# Altium schematic sheet Rover_PI_hat.SchDoc
size A; Author: Hannah Cho; DrawnBy: Hannah Cho; SheetNumber: 1; SheetTotal: 1
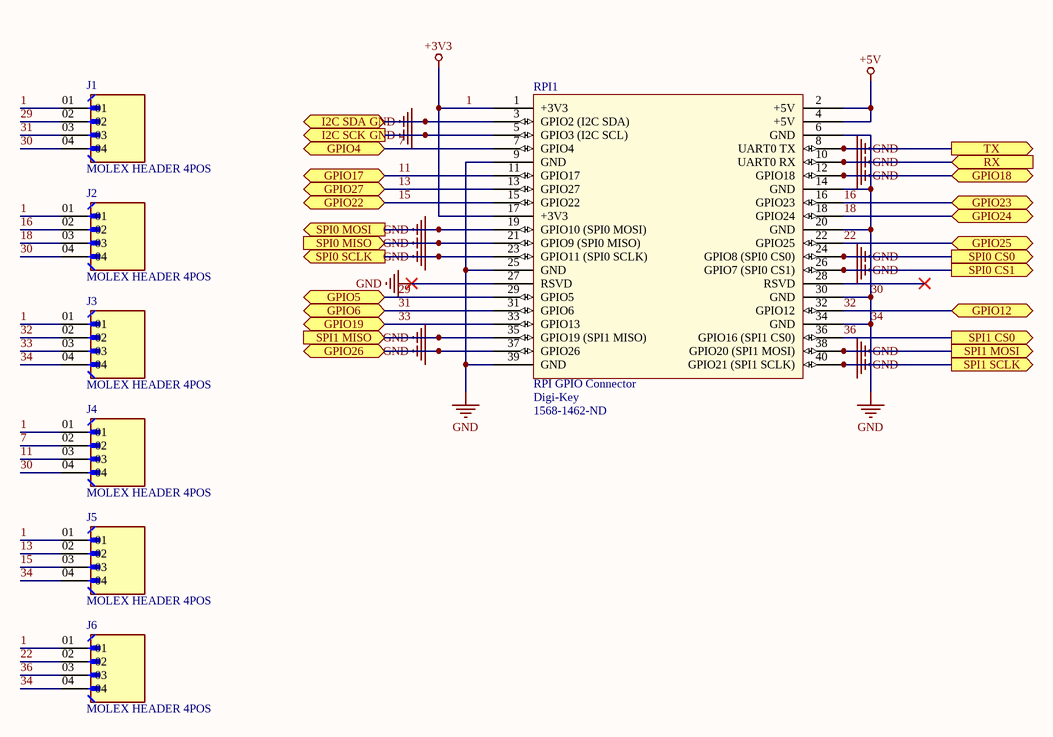
[diagram p0: Rover_PI_hat.SchDoc]

## Parts
J1  MOLEX HEADER 4POS  [MOLEX_35362-0450]
J2  MOLEX HEADER 4POS  [MOLEX_35362-0450]
J3  MOLEX HEADER 4POS  [MOLEX_35362-0450]
J4  MOLEX HEADER 4POS  [MOLEX_35362-0450]
J5  MOLEX HEADER 4POS  [MOLEX_35362-0450]
J6  MOLEX HEADER 4POS  [MOLEX_35362-0450]
RPI1  RPI GPIO Connector  Supplier 1: Digi-Key  Supplier Part Number 1: 1568-1462-ND  [rpi]

## Ports
GPIO4 (bidir), GPIO5 (bidir), GPIO6 (bidir), GPIO12 (bidir), GPIO17 (bidir), GPIO18 (bidir), GPIO19 (bidir), GPIO22 (bidir), GPIO23 (bidir), GPIO24 (bidir), GPIO25 (bidir), GPIO26 (bidir), GPIO27 (bidir), I2C SCK (out), I2C SDA (bidir), RX (in), SPI0 CS0 (out), SPI0 CS1 (out), SPI0 MISO (in), SPI0 MOSI (out), SPI0 SCLK (out), SPI1 CS0 (out), SPI1 MISO (in), SPI1 MOSI (out), SPI1 SCLK (out), TX (out)

## Nets
1: J1.01 J2.01 J3.01 J4.01 J5.01 J6.01 RPI1.1(+3V3) RPI1.17(+3V3)  [also labelled +3V3]
30: J1.04 J2.04 J3.04 J4.04 J5.04 J6.04 RPI1.3(GPIO2_(I2C_SDA)) RPI1.5(GPIO3_(I2C_SCL)) RPI1.6(GND) RPI1.8(UART0_TX) RPI1.9(GND) RPI1.10(UART0_RX) RPI1.12(GPIO18) RPI1.14(GND) RPI1.19(GPIO10_(SPI0_MOSI)) RPI1.20(GND) RPI1.21(GPIO9_(SPI0_MISO)) RPI1.23(GPIO11_(SPI0_SCLK)) RPI1.24(GPIO8_(SPI0_CS0)) RPI1.25(GND) RPI1.26(GPIO7_(SPI0_CS1)) RPI1.27(RSVD) RPI1.30(GND) RPI1.34(GND) RPI1.35(GPIO19_(SPI1_MISO)) RPI1.37(GPIO26) RPI1.38(GPIO20_(SPI1_MOSI)) RPI1.39(GND) RPI1.40(GPIO21_(SPI1_SCLK)) ; port I2C SDA, port I2C SCK, port SPI0 MOSI, port SPI0 MISO, port SPI0 SCLK, port GPIO26, port SPI1 MISO, port SPI1 MOSI, port SPI0 CS1, port SPI1 SCLK, port SPI0 CS0, port RX, port TX, port GPIO18  [also labelled 34, GND]
+5V: RPI1.2(+5V) RPI1.4(+5V)
7: J4.02 RPI1.7(GPIO4) ; port GPIO4
11: J4.03 RPI1.11(GPIO17) ; port GPIO17
13: J5.02 RPI1.13(GPIO27) ; port GPIO27
15: J5.03 RPI1.15(GPIO22) ; port GPIO22
16: J2.02 RPI1.16(GPIO23) ; port GPIO23
18: J2.03 RPI1.18(GPIO24) ; port GPIO24
22: J6.02 RPI1.22(GPIO25) ; port GPIO25
29: J1.02 RPI1.29(GPIO5) ; port GPIO5
31: J1.03 RPI1.31(GPIO6) ; port GPIO6
32: J3.02 RPI1.32(GPIO12) ; port GPIO12
33: J3.03 RPI1.33(GPIO13) ; port GPIO19
36: J6.03 RPI1.36(GPIO16_(SPI1_CS0)) ; port SPI1 CS0

Not connected (* = marked no-connect by the designer): RPI1 28(RSVD)*

## Library data of the parts
J1-J6 = 35362-0450: Connector Header Through Hole 4 position 0.079 (2.00mm); SnapEDA_Link: https://www.snapeda.com/parts/35362-0450/Molex/view-part/?ref=snap; Availability: In Stock; MP: 35362-0450; Price: None; Value: *; Check_prices: https://www.snapeda.com/parts/35362-0450/Molex/view-part/?ref=eda; MF: Molex; Package: None
RPI1 = rpi connector: GPIO Header for Raspberry Pi A+/B+/Pi 2/Pi 3 - 2x20; Manufacturer: SparkFun Electronics; Manufacturer Part Number: PRT-14017; Nils Minor: author; nilsminor@web.de: mail; RoHS: RoHS Compliant; Category: Development Boards, Kits, Programmers; Stock 1: 150; Pricing 1: 1=1.84 (EUR); Part Status: Active; Accessory Type: Connector; For Use With/Related Products: Raspberry Pi; ComponentLink1URL: https://cdn.sparkfun.com/datasheets/Dev/RaspberryPi/12313.pdf; ComponentLink1Description: https://cdn.sparkfun.com/datasheets/Dev/RaspberryPi/12313.pdf